# Altium project XTMCU02.PrjPcb
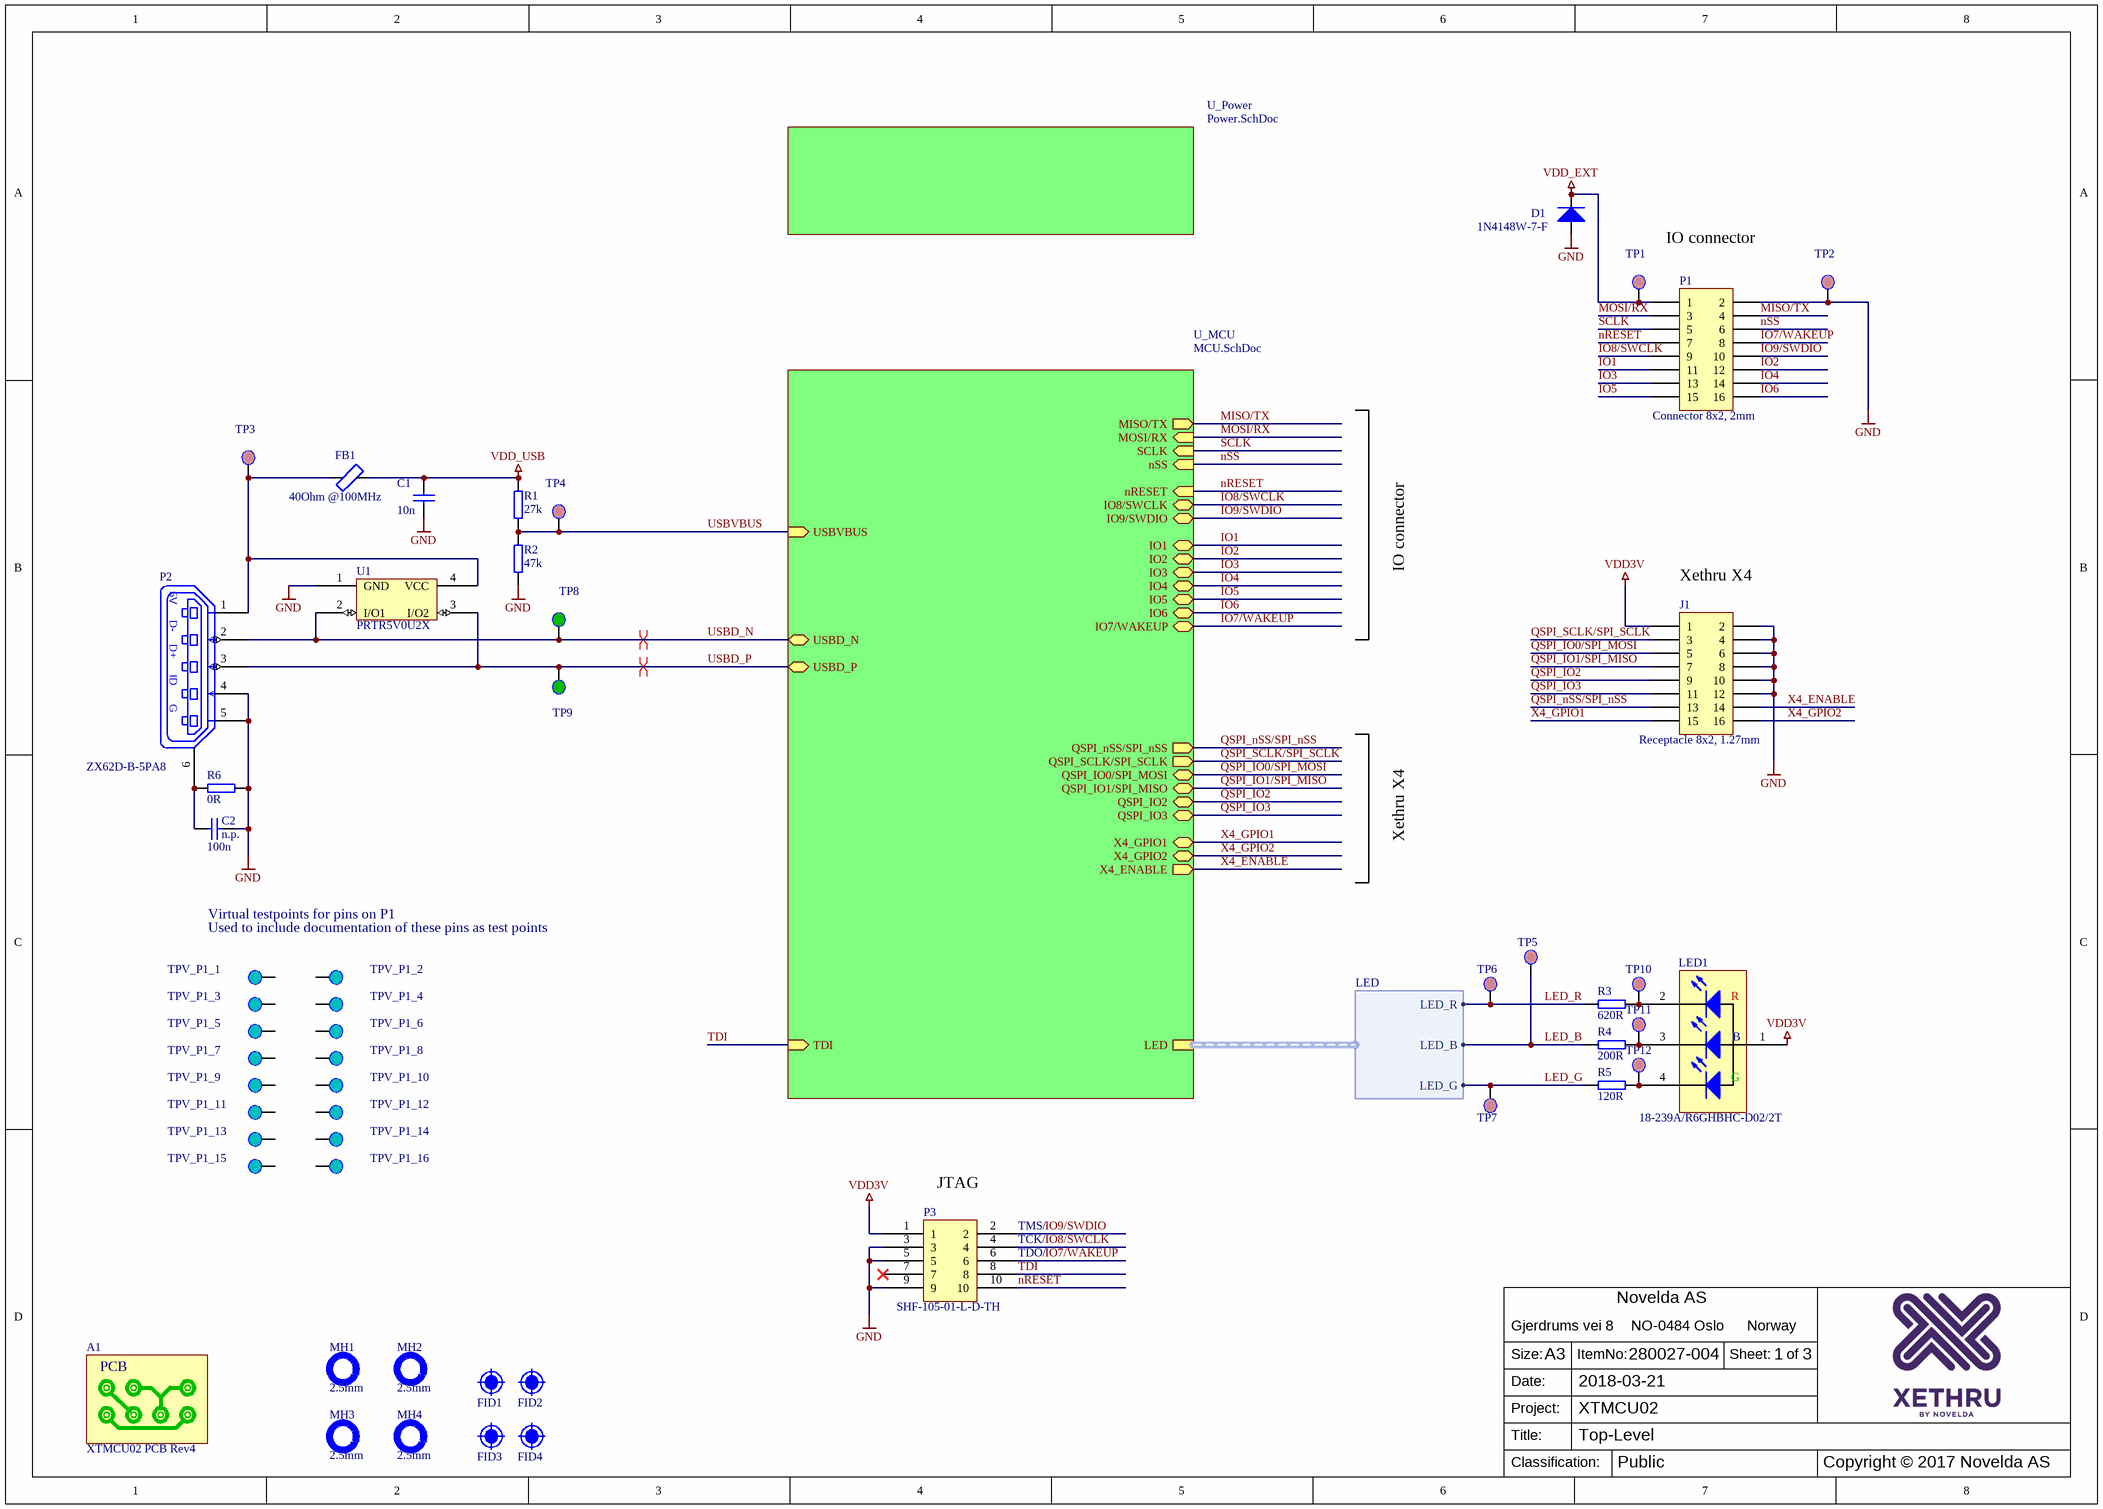
[diagram p0: Top-level.SchDoc]
PCBA_ProjectName: XTMCU02; PCBA_ItemNo: 280027-004; PCBA_Description: Cortex M7 based MCU card for use with X4 radar modules; PCBA_Date: 2018-03-21; PCBA_Classification: Public; PCB_ItemNo: 290052-004; PCB_Date: 2018-03-21; PCB_Classification: Public
3 sheets, 126 parts. Net scope: hierarchical (ports join the sheet entries above them; power ports are global).
Board file: XTMCU02.PcbDoc
Sheets:
  Top-level.SchDoc
    U_MCU = MCU.SchDoc
    U_Power = Power.SchDoc

## Sheet Top-level.SchDoc: Top-Level
size A3; CompanyName: Novelda AS; Organization: Novelda AS; Address1: Gjerdrums vei 8; Address2: NO-0484 Oslo; Address3: Norway; Revision: 1.A; SheetNumber: 1; SheetTotal: 3; Classification: Restricted; Size: A3; Project: X4M01; ProjectName: Prosject Name

### Parts
A1  XTMCU02 PCB Rev4  (mechanical)
C1  10n  [0402-CAPACITOR-NONPOL]
C2  100n  Notes: n.p.  [0603-CAPACITOR-NONPOL]
D1  1N4148W-7-F  [200048]
FB1  40Ohm @100MHz  [200017]
FID1  Fiducial  [ALTIUM-0005]  (value not drawn)  (no BOM)
FID2  Fiducial  [ALTIUM-0005]  (value not drawn)  (no BOM)
FID3  Fiducial  [ALTIUM-0005]  (value not drawn)  (no BOM)
FID4  Fiducial  [ALTIUM-0005]  (value not drawn)  (no BOM)
J1  Receptacle 8x2, 1.27mm  [200283]
LED1  18-239A/R6GHBHC-D02/2T  [200018]
MH1  2.5mm  [ALTIUM-0003]  (no BOM)
MH2  2.5mm  [ALTIUM-0003]  (no BOM)
MH3  2.5mm  [ALTIUM-0003]  (no BOM)
MH4  2.5mm  [ALTIUM-0003]  (no BOM)
P1  Connector 8x2, 2mm  [200019]
P2  ZX62D-B-5PA8  [200020]
P3  SHF-105-01-L-D-TH  [200073]
R1  27k  [0402-RESISTOR]
R2  47k  [0402-RESISTOR]
R3  620R  [0402-RESISTOR]
R4  200R  [0402-RESISTOR]
R5  120R  [0402-RESISTOR]
R6  0R  [0603-RESISTOR]
TP1  TP-MDA  [ALTIUM-0001]  (value not drawn)  (no BOM)
TP2  TP-MDA  [ALTIUM-0001]  (value not drawn)  (no BOM)
TP3  TP-MDA  [ALTIUM-0001]  (value not drawn)  (no BOM)
TP4  TP-MDA  [ALTIUM-0001]  (value not drawn)  (no BOM)
TP5  TP-MDA  [ALTIUM-0001]  (value not drawn)  (no BOM)
TP6  TP-MDA  [ALTIUM-0001]  (value not drawn)  (no BOM)
TP7  TP-MDA  [ALTIUM-0001]  (value not drawn)  (no BOM)
TP8  TP  [ALTIUM-0001]  (value not drawn)  (no BOM)
TP9  TP  [ALTIUM-0001]  (value not drawn)  (no BOM)
TP10  TP-MDA  [ALTIUM-0001]  (value not drawn)  (no BOM)
TP11  TP-MDA  [ALTIUM-0001]  (value not drawn)  (no BOM)
TP12  TP-MDA  [ALTIUM-0001]  (value not drawn)  (no BOM)
TPV_P1_1  TPV  (value not drawn)  (graphical)
TPV_P1_2  TPV  (value not drawn)  (graphical)
TPV_P1_3  TPV  (value not drawn)  (graphical)
TPV_P1_4  TPV  (value not drawn)  (graphical)
TPV_P1_5  TPV  (value not drawn)  (graphical)
TPV_P1_6  TPV  (value not drawn)  (graphical)
TPV_P1_7  TPV  (value not drawn)  (graphical)
TPV_P1_8  TPV  (value not drawn)  (graphical)
TPV_P1_9  TPV  (value not drawn)  (graphical)
TPV_P1_10  TPV  (value not drawn)  (graphical)
TPV_P1_11  TPV  (value not drawn)  (graphical)
TPV_P1_12  TPV  (value not drawn)  (graphical)
TPV_P1_13  TPV  (value not drawn)  (graphical)
TPV_P1_14  TPV  (value not drawn)  (graphical)
TPV_P1_15  TPV  (value not drawn)  (graphical)
TPV_P1_16  TPV  (value not drawn)  (graphical)
U1  PRTR5V0U2X  [200051]

### Sub-sheets
U_MCU = MCU.SchDoc: nRESET (in), IO7/WAKEUP (bidir), IO9/SWDIO (bidir), IO8/SWCLK (bidir), IO2 (bidir), IO1 (bidir), IO4 (bidir), IO3 (bidir), USBD_P (bidir), USBD_N (bidir), IO5 (bidir), IO6 (bidir), USBVBUS (in), MISO/TX (out), MOSI/RX (in), SCLK (in), nSS (in), LED (harness LED), QSPI_nSS/SPI_nSS (out), QSPI_IO1/SPI_MISO (bidir), QSPI_IO0/SPI_MOSI (bidir), QSPI_IO3 (bidir), QSPI_SCLK/SPI_SCLK (out), X4_GPIO2 (bidir), X4_GPIO1 (bidir), X4_ENABLE (out), QSPI_IO2 (bidir), TDI (in)
U_Power = Power.SchDoc: no entries

### Harnesses
LED: LED_R, LED_B, LED_G

### Nets
GND: C1.1 C2.2 D1.A J1.2 J1.4 J1.6 J1.8 J1.10 J1.12 P1.2 P2.4(ID) P2.5(G) P3.3 P3.5 P3.9 R2.1 R6.2 TP2.1 U1.1(GND)
VDD3V: J1.1 LED1.1(A) P3.1
VDD_EXT: D1.K P1.1 TP1.1
VDD_USB: C1.2 FB1.1 R1.1
IO1: P1.11 ; sheet U_MCU/IO1
IO2: P1.12 ; sheet U_MCU/IO2
IO3: P1.13 ; sheet U_MCU/IO3
IO4: P1.14 ; sheet U_MCU/IO4
IO5: P1.15 ; sheet U_MCU/IO5
IO6: P1.16 ; sheet U_MCU/IO6
IO7/WAKEUP: P1.8 P3.6 ; sheet U_MCU/IO7/WAKEUP
IO8/SWCLK: P1.9 P3.4 ; sheet U_MCU/IO8/SWCLK
IO9/SWDIO: P1.10 P3.2 ; sheet U_MCU/IO9/SWDIO
LED_B: R4.2 TP5.1 ; sheet U_MCU/LED.LED_B
LED_G: R5.2 TP7.1 ; sheet U_MCU/LED.LED_G
LED_R: R3.2 TP6.1 ; sheet U_MCU/LED.LED_R
MISO/TX: P1.4 ; sheet U_MCU/MISO/TX
MOSI/RX: P1.3 ; sheet U_MCU/MOSI/RX
nRESET: P1.7 P3.10 ; sheet U_MCU/nRESET
nSS: P1.6 ; sheet U_MCU/nSS
QSPI_IO0/SPI_MOSI: J1.5 ; sheet U_MCU/QSPI_IO0/SPI_MOSI
QSPI_IO1/SPI_MISO: J1.7 ; sheet U_MCU/QSPI_IO1/SPI_MISO
QSPI_IO2: J1.9 ; sheet U_MCU/QSPI_IO2
QSPI_IO3: J1.11 ; sheet U_MCU/QSPI_IO3
QSPI_nSS/SPI_nSS: J1.13 ; sheet U_MCU/QSPI_nSS/SPI_nSS
QSPI_SCLK/SPI_SCLK: J1.3 ; sheet U_MCU/QSPI_SCLK/SPI_SCLK
SCLK: P1.5 ; sheet U_MCU/SCLK
TDI: P3.8 ; sheet U_MCU/TDI
USBD_N: P2.2(D-) TP8.1 U1.2(I/O1) ; sheet U_MCU/USBD_N
USBD_P: P2.3(D+) TP9.1 U1.3(I/O2) ; sheet U_MCU/USBD_P
USBVBUS: R1.2 R2.2 TP4.1 ; sheet U_MCU/USBVBUS
X4_ENABLE: J1.14 ; sheet U_MCU/X4_ENABLE
X4_GPIO1: J1.15 ; sheet U_MCU/X4_GPIO1
X4_GPIO2: J1.16 ; sheet U_MCU/X4_GPIO2
NetC2_1: C2.1 P2.6(SH) R6.1
NetFB1_2: FB1.2 P2.1(5V) TP3.1 U1.4(VCC)
NetLED1_2: LED1.2(K_RED) R3.1 TP10.1
NetLED1_3: LED1.3(K_BLUE) R4.1 TP11.1
NetLED1_4: LED1.4(K_GREEN) R5.1 TP12.1

Not connected (* = marked no-connect by the designer): P3 7*; TPV_P1_1 1; TPV_P1_2 1; TPV_P1_3 1; TPV_P1_4 1; TPV_P1_5 1; TPV_P1_6 1; TPV_P1_7 1; TPV_P1_8 1; TPV_P1_9 1; TPV_P1_10 1; TPV_P1_11 1; TPV_P1_12 1; TPV_P1_13 1; TPV_P1_14 1; TPV_P1_15 1; TPV_P1_16 1

### Layout directives
differential pair: USBD_N, USBD_P

### Notes on the sheet
- IO connector
- (near J1) Xethru X4
- Xethru X4
- Virtual testpoints for pins on P1
- Used to include documentation of these pins as test points
- (near P3) JTAG
- (near P3) TMS/
- (near P3) TCK/
- (near P3) TDO/
- Size:
- Date:
- ItemNo:
- Sheet:
- of
- Title:
- Project:
- Classification:
- Copyright © 2017 Novelda AS
- (in symbol 200018) R; B; G

### Library data of the parts
A1 = 290052-004: Manufacturer: Novelda; Component Status: New; ItemNo: 290052-004; Value: XTMCU02 PCB Rev4; Component Category: PCB; MPN: 290052-004; ClassName: -; Notes: -
C1 = 200005: CAPACITOR, 10n, 0402, 20%, 25V, X7R; ItemNo: 200005; Component Status: Active; Value: 10n; Component Category: Capacitor; Manufacturer: --; Supplier: Farnell Norge; SupplierCatNo: 1758924
C2 = 200152: CAPACITOR, 100n, 0603, 10%, 16V, X7R; ItemNo: 200152; Component Status: New; Value: 100n; Component Category: Capacitor; Manufacturer: --; Supplier: Farnell Norge; SupplierCatNo: 1759016; ClassName: -
D1 = 200164: DIODE, 1N4148W-7-F, SWITCH, 300MA, 100V, SOD123; ItemNo: 200164; Component Status: New; Value: 1N4148W-7-F; Component Category: Diode; Manufacturer: --; ClassName: -; Notes: -; Supplier: Digi-Key; SupplierCatNo: 1N4148W-FDICT-ND
FB1 = 200017: FERRITE 1.5A 40 OHM 0805 SMD; Manufacturer: Laird-Signal Integrity Product; MPN: MI0805K400R-10; Component Status: Active; Component Category: Inductor; ItemNo: 200017; Value: 40Ohm @100MHz; Supplier: Digi-Key; SupplierCatNo: 240-2389-1-ND
FID1-FID4 = ALTIUM-0005: Fiduial 1.1mm; Component Status: Active; Component Category: Misc; ItemNo: ALTIUM-0005; Value: Fiducial; ClassName: Fiducial
J1 = 200283: CONNECTOR, RECEPTACLE, 1.27MM, THT, 8WAY, 2ROW; Manufacturer: Harwin; MPN: M50-3000845; Component Status: New; ItemNo: 200283; Value: Receptacle 8x2, 1.27mm; Component Category: Connector; ClassName: -; Notes: -; Supplier: Digi-Key; SupplierCatNo: 952-1367-5-ND
LED1 = 200018: LED RGB, 0404, Everlight 18-239A/R6GHBHC-D02/2T; Int_Manufacturer: Lumex; Component Status: New; ItemNo: 200018; Value: 18-239A/R6GHBHC-D02/2T; Component Category: LED; Manufacturer: Everlight; MPN: 18-239A/R6GHBHC-D02/2T; Supplier: Digi-Key; SupplierCatNo: 67-2125-1-ND
MH1-MH4 = ALTIUM-0003: MOUNTING-HOLE-2.5mm, WITHOUT NET; Component Status: Active; Component Category: Misc; ItemNo: ALTIUM-0003; Value: 2.5mm
P1 = 200019: BOARD-BOARD CONNECTOR HEADER, 8WAY, 2ROW, 2MM PITCH; Manufacturer: PINREX; MPN: 220-92-08GB22; Component Status: Active; ItemNo: 200019; Value: Connector 8x2, 2mm; Component Category: Connector; Supplier: Farnell Norge; SupplierCatNo: 1668543
P2 = 200020: CONNECTOR, MICRO USB, RECEPTACLE, 5WAY; Manufacturer: Hirose; Component Status: Active; ItemNo: 200020; Value: ZX62D-B-5PA8; Component Category: Connector; MPN: ZX62D-B-5PA8; Supplier: Farnell Norge; SupplierCatNo: 2300438
P3 = 200073: CONNECTOR, 1.27MM, THRU HOLE, 2X5WAY; Manufacturer: Samtec; Component Status: Active; ItemNo: 200073; Value: SHF-105-01-L-D-TH; Component Category: Connector; MPN: SHF-105-01-L-D-TH; ClassName: -; Notes: -; Supplier: Farnell Norge; SupplierCatNo: 2308450
R1 = 200062: RESISTOR, 27k, 0402, 1%, 63mW; ItemNo: 200062; Component Status: Active; Value: 27k; Component Category: Resistor; Manufacturer: --; Supplier: Farnell Norge; SupplierCatNo: 2331498
R2 = 200063: RESISTOR, 47k, 0402, 1%, 63mW; ItemNo: 200063; Component Status: Active; Value: 47k; Component Category: Resistor; Manufacturer: --; Supplier: Farnell Norge; SupplierCatNo: 1469719
R3 = 200032: RESISTOR, 620R, 0402, 1%, 63mW; ItemNo: 200032; Component Status: Active; Value: 620R; Component Category: Resistor; Manufacturer: --; Supplier: Farnell Norge; SupplierCatNo: 2331552
R4 = 200031: RESISTOR, 200R, 0402, 1%, 63mW; ItemNo: 200031; Component Status: Active; Value: 200R; Component Category: Resistor; Manufacturer: --; Supplier: Farnell Norge; SupplierCatNo: 2331484
R5 = 200030: RESISTOR, 120R, 0402, 1%, 63mW; ItemNo: 200030; Component Status: Active; Value: 120R; Component Category: Resistor; Manufacturer: --; Supplier: Farnell Norge; SupplierCatNo: 2331452
R6 = 200305: RESISTOR, 0R, 0603, 1%, 100mW; ItemNo: 200305; Component Status: New; Value: 0R; Component Category: Resistor; Manufacturer: --; Supplier: Farnell Norge; SupplierCatNo: 2309111; ClassName: -; Notes: -
TP1 TP2 TP4-TP7 TP10-TP12 = ALTIUM-0023: TESTPOINT FOR MDA-TEST, 1mm ROUND, SMD; Component Status: Active; Component Category: Misc; TP_Type: MDA; ItemNo: ALTIUM-0023; Value: TP-MDA; ClassName: MDA-Testpoint
TP3 = ALTIUM-0023: TESTPOINT FOR MDA-TEST, 1mm ROUND, SMD; Component Status: Active; Component Category: Misc; TP_Type: Testjig,MDA; TP_LegalValueRange: 4.5V - 5.5V; TP_Notes: USB supply voltage; ItemNo: ALTIUM-0023; Value: TP-MDA; ClassName: MDA-Testpoint
TP8 = ALTIUM-0001: TESTPOINT, 1mm ROUND, SMD; Component Status: Active; Component Category: Misc; TP_Type: Testjig; TP_Notes: USB Data-; ItemNo: ALTIUM-0001; Value: TP; ClassName: Testpoint
TP9 = ALTIUM-0001: TESTPOINT, 1mm ROUND, SMD; Component Status: Active; Component Category: Misc; TP_Type: Testjig; TP_Notes: USB Data+; ItemNo: ALTIUM-0001; Value: TP; ClassName: Testpoint
TPV_P1_1 = ALTIUM-0007: TESTPOINT, Virtual, Only on schematic, Used when actual testpoint is other component pins.; Component Status: Active; Component Category: Misc; TP_Type: Testjig; TP_LegalValueRange: 4.5V - 5.5V; TP_Notes: External voltage input; ItemNo: ALTIUM-0007; Value: TPV; ClassName: Testpoint
TPV_P1_2 = ALTIUM-0007: TESTPOINT, Virtual, Only on schematic, Used when actual testpoint is other component pins.; Component Status: Active; Component Category: Misc; TP_Type: Testjig; TP_LegalValueRange: 0V; TP_Notes: GND; ItemNo: ALTIUM-0007; Value: TPV; ClassName: Testpoint
TPV_P1_3 = ALTIUM-0007: TESTPOINT, Virtual, Only on schematic, Used when actual testpoint is other component pins.; Component Status: Active; Component Category: Misc; TP_Type: Testjig; TP_Notes: SPI MOSI/UART RX; ItemNo: ALTIUM-0007; Value: TPV; ClassName: Testpoint
TPV_P1_4 = ALTIUM-0007: TESTPOINT, Virtual, Only on schematic, Used when actual testpoint is other component pins.; Component Status: Active; Component Category: Misc; TP_Type: Testjig; TP_Notes: SPI MISO/UART TX; ItemNo: ALTIUM-0007; Value: TPV; ClassName: Testpoint
TPV_P1_5 = ALTIUM-0007: TESTPOINT, Virtual, Only on schematic, Used when actual testpoint is other component pins.; Component Status: Active; Component Category: Misc; TP_Type: Testjig; TP_Notes: SPI SCLK; ItemNo: ALTIUM-0007; Value: TPV; ClassName: Testpoint
TPV_P1_6 = ALTIUM-0007: TESTPOINT, Virtual, Only on schematic, Used when actual testpoint is other component pins.; Component Status: Active; Component Category: Misc; Notes: Active Low; TP_Type: Testjig; TP_Notes: SPI NSS; ItemNo: ALTIUM-0007; Value: TPV; ClassName: Testpoint
TPV_P1_7 = ALTIUM-0007: TESTPOINT, Virtual, Only on schematic, Used when actual testpoint is other component pins.; Component Status: Active; Component Category: Misc; Notes: Use for programming; TP_Type: Testjig; TP_Notes: MCU nRESET; ItemNo: ALTIUM-0007; Value: TPV; ClassName: Testpoint
TPV_P1_8 = ALTIUM-0007: TESTPOINT, Virtual, Only on schematic, Used when actual testpoint is other component pins.; Component Status: Active; Component Category: Misc; TP_Type: Testjig; TP_Notes: IO7/WAKEUP; ItemNo: ALTIUM-0007; Value: TPV; ClassName: Testpoint
TPV_P1_9 = ALTIUM-0007: TESTPOINT, Virtual, Only on schematic, Used when actual testpoint is other component pins.; Component Status: Active; Component Category: Misc; TP_Type: Testjig; TP_Notes: IO8/SWCLK; ItemNo: ALTIUM-0007; Value: TPV; ClassName: Testpoint
TPV_P1_10 = ALTIUM-0007: TESTPOINT, Virtual, Only on schematic, Used when actual testpoint is other component pins.; Component Status: Active; Component Category: Misc; TP_Type: Testjig; TP_Notes: IO9/SWDIO; ItemNo: ALTIUM-0007; Value: TPV; ClassName: Testpoint
TPV_P1_11 = ALTIUM-0007: TESTPOINT, Virtual, Only on schematic, Used when actual testpoint is other component pins.; Component Status: Active; Component Category: Misc; TP_Type: Testjig; TP_Notes: IO1; ItemNo: ALTIUM-0007; Value: TPV; ClassName: Testpoint
TPV_P1_12 = ALTIUM-0007: TESTPOINT, Virtual, Only on schematic, Used when actual testpoint is other component pins.; Component Status: Active; Component Category: Misc; TP_Type: Testjig; TP_Notes: IO2; ItemNo: ALTIUM-0007; Value: TPV; ClassName: Testpoint
TPV_P1_13 = ALTIUM-0007: TESTPOINT, Virtual, Only on schematic, Used when actual testpoint is other component pins.; Component Status: Active; Component Category: Misc; TP_Type: Testjig; TP_Notes: IO3; ItemNo: ALTIUM-0007; Value: TPV; ClassName: Testpoint
TPV_P1_14 = ALTIUM-0007: TESTPOINT, Virtual, Only on schematic, Used when actual testpoint is other component pins.; Component Status: Active; Component Category: Misc; TP_Type: Testjig; TP_Notes: IO4; ItemNo: ALTIUM-0007; Value: TPV; ClassName: Testpoint
TPV_P1_15 = ALTIUM-0007: TESTPOINT, Virtual, Only on schematic, Used when actual testpoint is other component pins.; Component Status: Active; Component Category: Misc; TP_Type: Testjig; TP_Notes: IO5; ItemNo: ALTIUM-0007; Value: TPV; ClassName: Testpoint
TPV_P1_16 = ALTIUM-0007: TESTPOINT, Virtual, Only on schematic, Used when actual testpoint is other component pins.; Component Status: Active; Component Category: Misc; TP_Type: Testjig; TP_Notes: IO6; ItemNo: ALTIUM-0007; Value: TPV; ClassName: Testpoint
U1 = 200051: DIODE PROTECTION, TVS, DUAL; Manufacturer: NXP; Component Status: Active; ItemNo: 200051; Value: PRTR5V0U2X; Component Category: Diode; MPN: PRTR5V0U2X; Supplier: Farnell Norge; SupplierCatNo: 2371119

## Sheet MCU.SchDoc: MCU
size A3; CompanyName: Novelda AS; Organization: Novelda AS; Address1: Gjerdrums vei 8; Address2: NO-0484 Oslo; Address3: Norway; Revision: 1.A; SheetNumber: 3; SheetTotal: 3; Classification: Restricted; Size: A3; Project: X4M01; ProjectName: Prosject Name
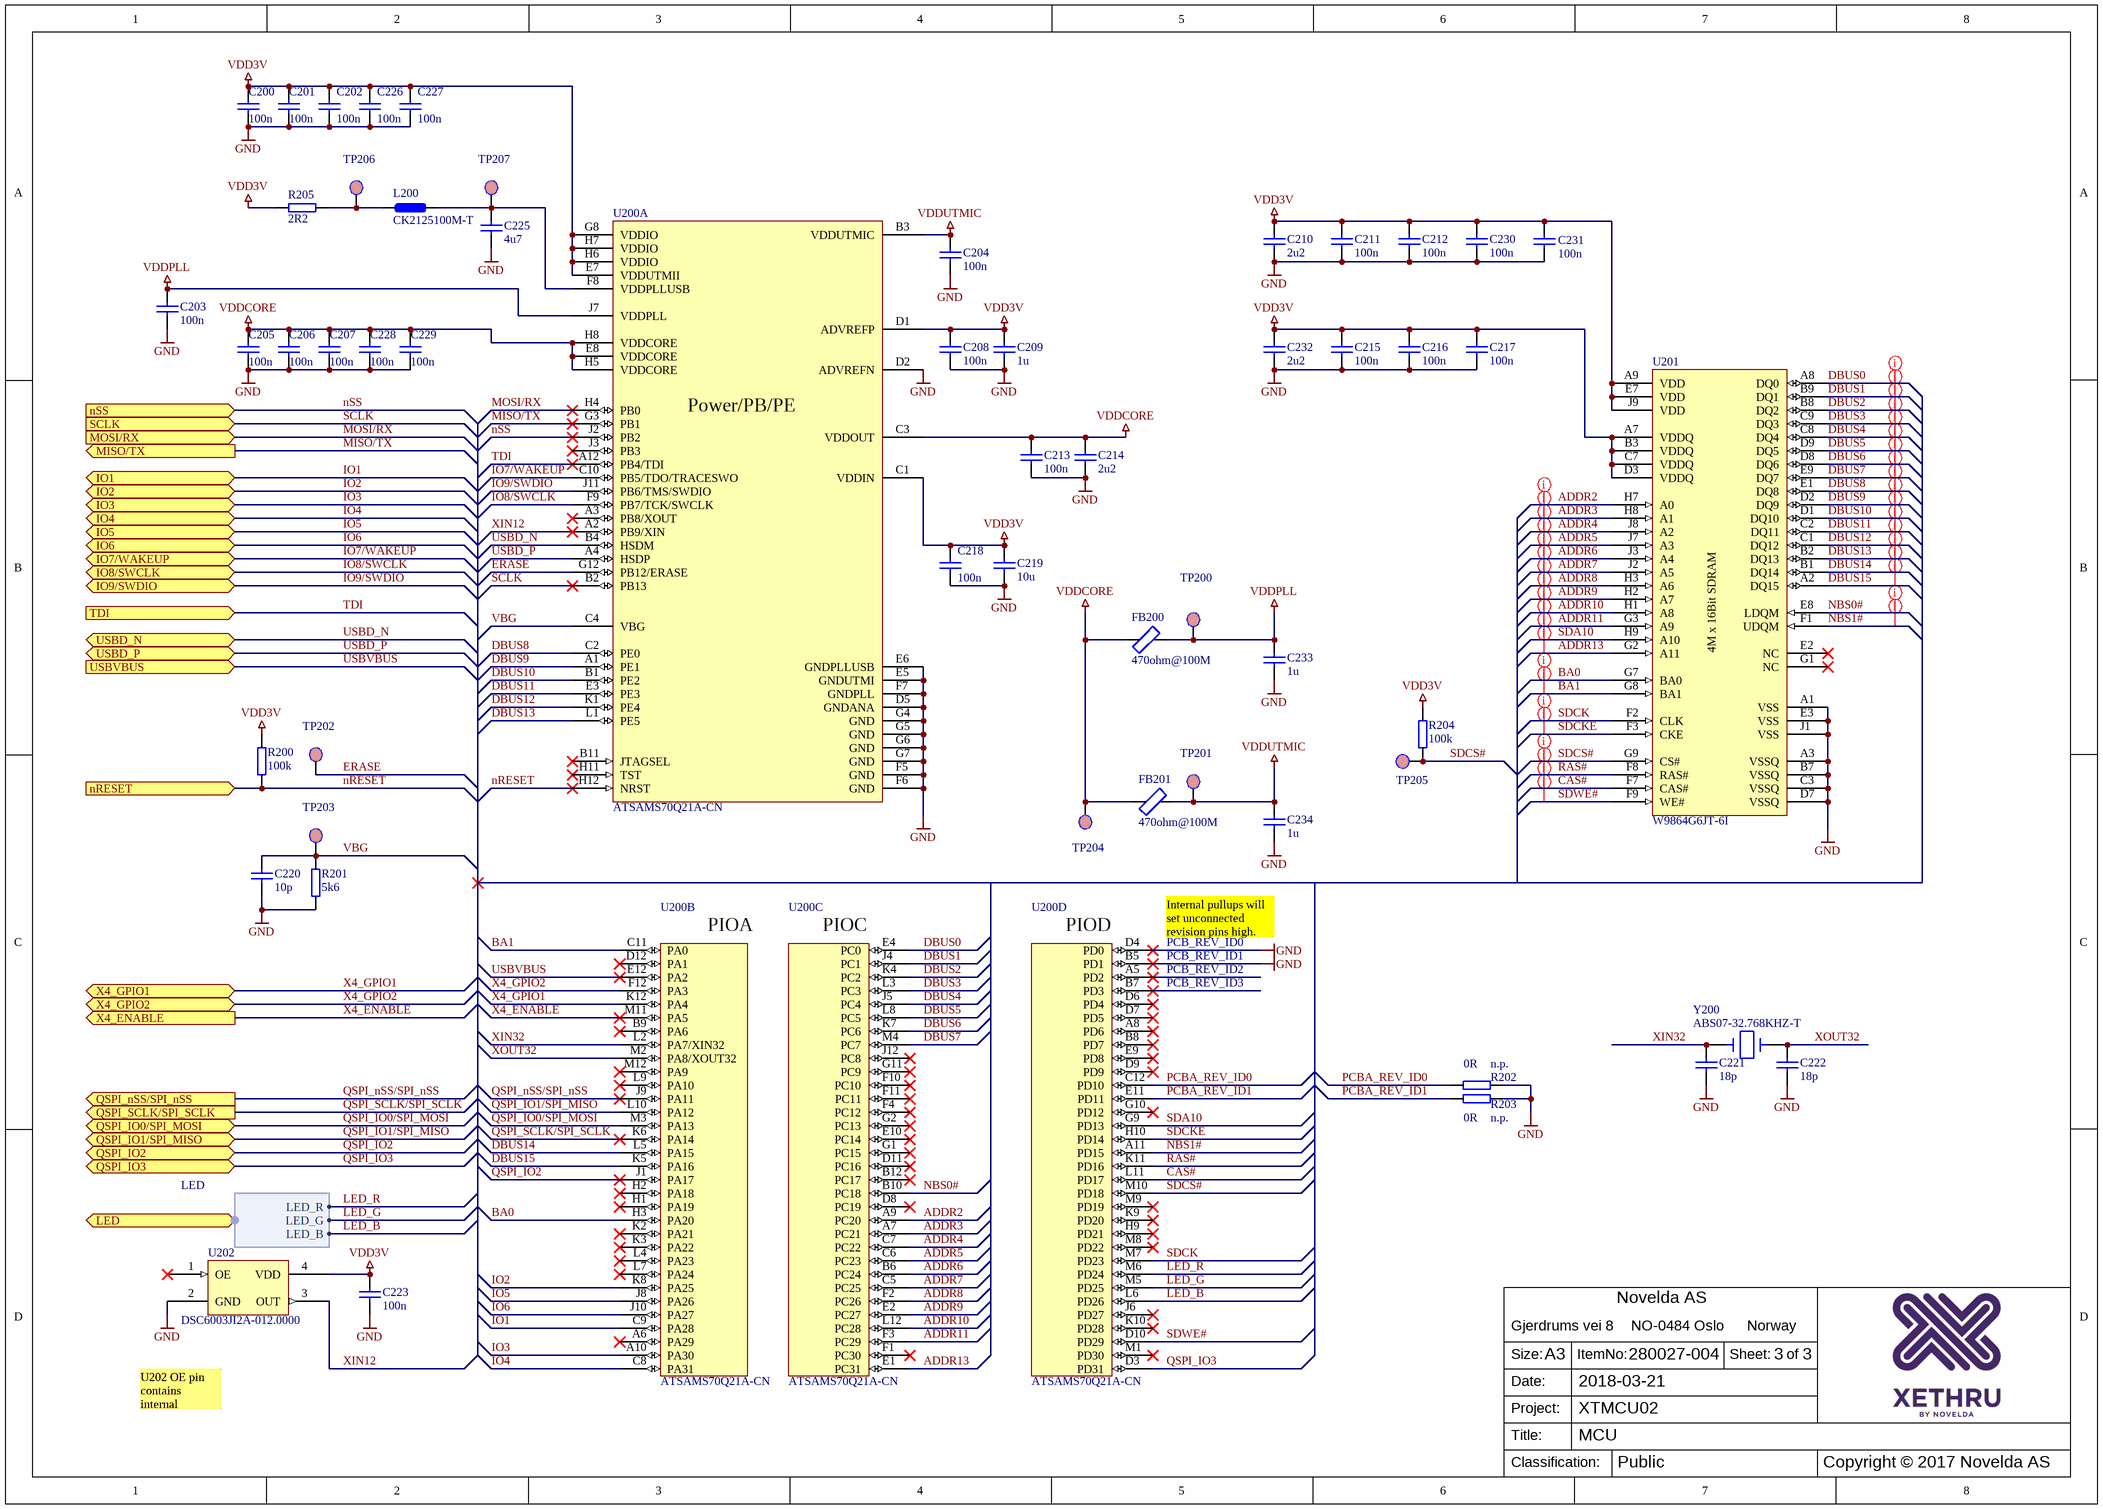
[diagram p1: MCU.SchDoc]

### Parts
C200  100n  [0402-CAPACITOR-NONPOL]
C201  100n  [0402-CAPACITOR-NONPOL]
C202  100n  [0402-CAPACITOR-NONPOL]
C203  100n  [0402-CAPACITOR-NONPOL]
C204  100n  [0402-CAPACITOR-NONPOL]
C205  100n  [0402-CAPACITOR-NONPOL]
C206  100n  [0402-CAPACITOR-NONPOL]
C207  100n  [0402-CAPACITOR-NONPOL]
C208  100n  [0402-CAPACITOR-NONPOL]
C209  1u  [0402-CAPACITOR-NONPOL]
C210  2u2  [0402-CAPACITOR-NONPOL]
C211  100n  [0402-CAPACITOR-NONPOL]
C212  100n  [0402-CAPACITOR-NONPOL]
C213  100n  [0402-CAPACITOR-NONPOL]
C214  2u2  [0402-CAPACITOR-NONPOL]
C215  100n  [0402-CAPACITOR-NONPOL]
C216  100n  [0402-CAPACITOR-NONPOL]
C217  100n  [0402-CAPACITOR-NONPOL]
C218  100n  [0402-CAPACITOR-NONPOL]
C219  10u  [0603-CAPACITOR-NONPOL]
C220  10p  [0402-CAPACITOR-NONPOL]
C221  18p  [0402-CAPACITOR-NONPOL]
C222  18p  [0402-CAPACITOR-NONPOL]
C223  100n  [0402-CAPACITOR-NONPOL]
C225  4u7  [0603-CAPACITOR-NONPOL]
C226  100n  [0402-CAPACITOR-NONPOL]
C227  100n  [0402-CAPACITOR-NONPOL]
C228  100n  [0402-CAPACITOR-NONPOL]
C229  100n  [0402-CAPACITOR-NONPOL]
C230  100n  [0402-CAPACITOR-NONPOL]
C231  100n  [0402-CAPACITOR-NONPOL]
C232  2u2  [0402-CAPACITOR-NONPOL]
C233  1u  [0402-CAPACITOR-NONPOL]
C234  1u  [0402-CAPACITOR-NONPOL]
FB200  470ohm@100M  [200047]
FB201  470ohm@100M  [200047]
L200  CK2125100M-T  [200364]
R200  100k  [0402-RESISTOR]
R201  5k6  [0402-RESISTOR]
R202  0R  Notes: n.p.  [0402-RESISTOR]
R203  0R  Notes: n.p.  [0402-RESISTOR]
R204  100k  [0402-RESISTOR]
R205  2R2  [0402-RESISTOR]
TP200  TP-MDA  [ALTIUM-0001]  (value not drawn)  (no BOM)
TP201  TP-MDA  [ALTIUM-0001]  (value not drawn)  (no BOM)
TP202  TP-MDA  [ALTIUM-0001]  (value not drawn)  (no BOM)
TP203  TP-MDA  [ALTIUM-0001]  (value not drawn)  (no BOM)
TP204  TP-MDA  [ALTIUM-0001]  (value not drawn)  (no BOM)
TP205  TP-MDA  [ALTIUM-0001]  (value not drawn)  (no BOM)
TP206  TP-MDA  [ALTIUM-0001]  (value not drawn)  (no BOM)
TP207  TP-MDA  [ALTIUM-0001]  (value not drawn)  (no BOM)
U200  ATSAMS70Q21A-CN  [200353]  (parts A,B,C,D of 4)
U201  W9864G6JT-6I  [200282]
U202  DSC6003JI2A-012.0000  [200365]
Y200  ABS07-32.768KHZ-T  [200042]

### Ports
IO1 (bidir), IO2 (bidir), IO3 (bidir), IO4 (bidir), IO5 (bidir), IO6 (bidir), IO7/WAKEUP (bidir), IO8/SWCLK (bidir), IO9/SWDIO (bidir), LED (harness LED), MISO/TX (out), MOSI/RX (in), nRESET (in), nSS (in), QSPI_IO0/SPI_MOSI (bidir), QSPI_IO1/SPI_MISO (bidir), QSPI_IO2 (bidir), QSPI_IO3 (bidir), QSPI_nSS/SPI_nSS (out), QSPI_SCLK/SPI_SCLK (out), SCLK (in), TDI (in), USBD_N (bidir), USBD_P (bidir), USBVBUS (in), X4_ENABLE (out), X4_GPIO1 (bidir), X4_GPIO2 (bidir)

### Harnesses
LED: LED_R, LED_B, LED_G

### Nets
GND: C200.2 C201.1 C202.1 C203.1 C204.1 C205.2 C206.1 C207.1 C208.1 C209.1 C210.2 C211.1 C212.1 C213.1 C214.2 C215.1 C216.1 C217.1 C218.1 C219.1 C220.2 C221.1 C222.1 C223.2 C225.1 C226.1 C227.1 C228.1 C229.1 C230.1 C231.1 C232.2 C233.1 C234.1 R201.1 R202.2 R203.2 U200.B5(PD1) U200.D2(ADVREFN) U200.D4(PD0) U200.D5(GNDANA) U200.E5(GNDUTMI) U200.E6(GNDPLLUSB) U200.F5(GND) U200.F6(GND) U200.F7(GNDPLL) U200.G4(GND) U200.G5(GND) U200.G6(GND) U200.G7(GND) U201.A1(VSS) U201.A3(VSSQ) U201.B7(VSSQ) U201.C3(VSSQ) U201.D7(VSSQ) U201.E3(VSS) U201.J1(VSS) U202.2(GND)
VDD3V: C200.1 C201.2 C202.2 C208.2 C209.2 C210.1 C211.2 C212.2 C215.2 C216.2 C217.2 C218.2 C219.2 C223.1 C226.2 C227.2 C230.2 C231.2 C232.1 R200.2 R204.2 R205.1 U200.C1(VDDIN) U200.D1(ADVREFP) U200.E7(VDDUTMII) U200.G8(VDDIO) U200.H6(VDDIO) U200.H7(VDDIO) U201.A7(VDDQ) U201.A9(VDD) U201.B3(VDDQ) U201.C7(VDDQ) U201.D3(VDDQ) U201.E7(VDD) U201.J9(VDD) U202.4(VDD)
VDDCORE: C205.1 C206.2 C207.2 C213.2 C214.1 C228.2 C229.2 FB200.1 FB201.1 TP204.1 U200.C3(VDDOUT) U200.E8(VDDCORE) U200.H5(VDDCORE) U200.H8(VDDCORE)
VDDPLL: C203.2 C233.2 FB200.2 TP200.1 U200.J7(VDDPLL)
VDDUTMIC: C204.2 C234.2 FB201.2 TP201.1 U200.B3(VDDUTMIC)
ADDR2: U200.A9(PC20) U201.H7(A0)
ADDR3: U200.A7(PC21) U201.H8(A1)
ADDR4: U200.C7(PC22) U201.J8(A2)
ADDR5: U200.C6(PC23) U201.J7(A3)
ADDR6: U200.B6(PC24) U201.J3(A4)
ADDR7: U200.C5(PC25) U201.J2(A5)
ADDR8: U200.F2(PC26) U201.H3(A6)
ADDR9: U200.E2(PC27) U201.H2(A7)
ADDR10: U200.L12(PC28) U201.H1(A8)
ADDR11: U200.F3(PC29) U201.G3(A9)
ADDR13: U200.E1(PC31) U201.G2(A11)
BA0: U200.H3(PA20) U201.G7(BA0)
BA1: U200.C11(PA0) U201.G8(BA1)
CAS#: U200.L11(PD17) U201.F7(CAS#)
DBUS0: U200.E4(PC0) U201.A8(DQ0)
DBUS1: U200.J4(PC1) U201.B9(DQ1)
DBUS2: U200.K4(PC2) U201.B8(DQ2)
DBUS3: U200.L3(PC3) U201.C9(DQ3)
DBUS4: U200.J5(PC4) U201.C8(DQ4)
DBUS5: U200.L8(PC5) U201.D9(DQ5)
DBUS6: U200.K7(PC6) U201.D8(DQ6)
DBUS7: U200.M4(PC7) U201.E9(DQ7)
DBUS8: U200.C2(PE0) U201.E1(DQ8)
DBUS9: U200.A1(PE1) U201.D2(DQ9)
DBUS10: U200.B1(PE2) U201.D1(DQ10)
DBUS11: U200.E3(PE3) U201.C2(DQ11)
DBUS12: U200.K1(PE4) U201.C1(DQ12)
DBUS13: U200.L1(PE5) U201.B2(DQ13)
DBUS14: U200.L5(PA15) U201.B1(DQ14)
DBUS15: U200.K5(PA16) U201.A2(DQ15)
ERASE: TP202.1 U200.G12(PB12/ERASE)
IO1: U200.C9(PA28) ; port IO1
IO2: U200.K8(PA25) ; port IO2
IO3: U200.A10(PA30) ; port IO3
IO4: U200.C8(PA31) ; port IO4
IO5: U200.J8(PA26) ; port IO5
IO6: U200.J10(PA27) ; port IO6
IO7/WAKEUP: U200.C10(PB5/TDO/TRACESWO) ; port IO7/WAKEUP
IO8/SWCLK: U200.F9(PB7/TCK/SWCLK) ; port IO8/SWCLK
IO9/SWDIO: U200.J11(PB6/TMS/SWDIO) ; port IO9/SWDIO
LED_B: U200.L6(PD26) ; port LED.LED_B
LED_G: U200.M5(PD25) ; port LED.LED_G
LED_R: U200.M6(PD24) ; port LED.LED_R
MISO/TX: U200.G3(PB1) ; port MISO/TX
MOSI/RX: U200.H4(PB0) ; port MOSI/RX
NBS0#: U200.B10(PC18) U201.E8(LDQM)
NBS1#: U200.A11(PD15) U201.F1(UDQM)
nRESET: R200.1 U200.H12(NRST) ; port nRESET
nSS: U200.J2(PB2) ; port nSS
PCBA_REV_ID0: R202.1 U200.C12(PD10)
PCBA_REV_ID1: R203.1 U200.E11(PD11)
QSPI_IO0/SPI_MOSI: U200.M3(PA13) ; port QSPI_IO0/SPI_MOSI
QSPI_IO1/SPI_MISO: U200.L10(PA12) ; port QSPI_IO1/SPI_MISO
QSPI_IO2: U200.J1(PA17) ; port QSPI_IO2
QSPI_IO3: U200.D3(PD31) ; port QSPI_IO3
QSPI_nSS/SPI_nSS: U200.J9(PA11) ; port QSPI_nSS/SPI_nSS
QSPI_SCLK/SPI_SCLK: U200.K6(PA14) ; port QSPI_SCLK/SPI_SCLK
RAS#: U200.K11(PD16) U201.F8(RAS#)
SCLK: U200.B2(PB13) ; port SCLK
SDA10: U200.G9(PD13) U201.H9(A10)
SDCK: U200.M7(PD23) U201.F2(CLK)
SDCKE: U200.H10(PD14) U201.F3(CKE)
SDCS#: R204.1 TP205.1 U200.M10(PD18) U201.G9(CS#)
SDWE#: U200.D10(PD29) U201.F9(WE#)
TDI: U200.A12(PB4/TDI) ; port TDI
USBD_N: U200.B4(HSDM) ; port USBD_N
USBD_P: U200.A4(HSDP) ; port USBD_P
USBVBUS: U200.E12(PA2) ; port USBVBUS
VBG: C220.1 R201.2 TP203.1 U200.C4(VBG)
X4_ENABLE: U200.M11(PA5) ; port X4_ENABLE
X4_GPIO1: U200.K12(PA4) ; port X4_GPIO1
X4_GPIO2: U200.F12(PA3) ; port X4_GPIO2
XIN12: U200.A2(PB9/XIN) U202.3(OUT)
XIN32: C221.2 U200.L2(PA7/XIN32) Y200.1
XOUT32: C222.2 U200.M2(PA8/XOUT32) Y200.2
NetC225_2: C225.2 L200.2 TP207.1 U200.F8(VDDPLLUSB)
NetL200_1: L200.1 R205.2 TP206.1

Not connected (* = marked no-connect by the designer): U200 A3(PB8/XOUT)* A5(PD2)* A6(PA29)* A8(PD6)* B7(PD3)* B8(PD7)* B9(PA6)* B11(JTAGSEL)* B12(PC17)* D6(PD4)* D7(PD5)* D8(PC19)* D9(PD9)* D11(PC16)* D12(PA1)* E9(PD8)* E10(PC14)* F1(PC30)* F4(PC12)* F10(PC10)* F11(PC11)* G1(PC15)* G2(PC13)* G10(PD12)* G11(PC9)* H1(PA19)* H2(PA18)* H9(PD21)* H11(TST)* J3(PB3)* J6(PD27)* J12(PC8)* K2(PA21)* K3(PA22)* K9(PD20)* K10(PD28)* L4(PA23)* L7(PA24)* L9(PA10)* M1(PD30)* M8(PD22)* M9(PD19)* M12(PA9)*; U201 E2(NC)* G1(NC)*; U202 1(OE)*

### Layout directives
net class ADDRESS_BUS: ADDR2, ADDR3, ADDR4, ADDR5, ADDR6, ADDR7, ADDR8, ADDR9, ADDR10, ADDR11, ADDR13, BA0, BA1, CAS#, NBS0#, NBS1#, RAS#, SDA10, SDCK, SDCKE, SDCS#, SDWE#
net class DATA_BUS: DBUS0, DBUS1, DBUS2, DBUS3, DBUS4, DBUS5, DBUS6, DBUS7, DBUS8, DBUS9, DBUS10, DBUS11, DBUS12, DBUS13, DBUS14, DBUS15

### Notes on the sheet
- PCB_REV_ID0
- PCB_REV_ID1
- PCB_REV_ID2
- PCB_REV_ID3
- Internal pullups will set unconnected revision pins high.
- U202 OE pin
  contains internal
  pull-up
- Size:
- Date:
- ItemNo:
- Sheet:
- of
- Title:
- Project:
- Classification:
- Copyright © 2017 Novelda AS
- (in symbol 200282) 4M x 16Bit SDRAM
- (in symbol 200353, part A) Power/PB/PE
- (in symbol 200353, part B) PIOA
- (in symbol 200353, part C) PIOC
- (in symbol 200353, part D) PIOD

### Library data of the parts
C200-C208 C211-C213 C215-C218 C223 C226-C231 = 200010: CAPACITOR, 100n, 0402, 10%, 10V, X5R; ItemNo: 200010; Component Status: Active; Value: 100n; Component Category: Capacitor; Manufacturer: --; Supplier: Farnell Norge; SupplierCatNo: 1759380
C209 C233 C234 = 200001: CAPACITOR, 1u, 0402, 10%, 10V, X5R; ItemNo: 200001; Component Status: Active; Value: 1u; Component Category: Capacitor; Manufacturer: --; Supplier: Farnell Norge; SupplierCatNo: 1759381
C210 C214 C232 = 200000: CAPACITOR, 2u2, 0402, 20%, 6V3, X5R; ItemNo: 200000; Component Status: Active; Value: 2u2; Component Category: Capacitor; Manufacturer: --; Supplier: Farnell Norge; SupplierCatNo: 2362091
C219 = 200011: CAPACITOR, 10u, 0603, 20%, 6V3, X5R; ItemNo: 200011; Component Status: Active; Value: 10u; Component Category: Capacitor; Manufacturer: --; Supplier: Farnell Norge; SupplierCatNo: 2611921
C220 = 200008: CAPACITOR, 10p, 0402, 5%, 50V, NP0; ItemNo: 200008; Component Status: Active; Value: 10p; Component Category: Capacitor; Manufacturer: --; Supplier: Farnell Norge; SupplierCatNo: 2320761
C221 C222 = 200012: CAPACITOR, 18p, 0402, 5%, 50V, NP0; ItemNo: 200012; Component Status: Active; Value: 18p; Component Category: Capacitor; Manufacturer: --; Supplier: Farnell Norge; SupplierCatNo: 1758947
C225 = 200128: CAPACITOR, 4u7, 0603, 10%, 10V, X5R; ItemNo: 200128; Component Status: Active; Value: 4u7; Component Category: Capacitor; Manufacturer: --; Supplier: Farnell Norge; SupplierCatNo: 2320818; ClassName: -; Notes: -
FB200 FB201 = 200047: FERRITE BEAD, 470ohm@100MHz, 1A; Manufacturer: Murata; MPN: BLM18PG471SN1D; Component Status: New; Component Category: Inductor; ItemNo: 200047; Value: 470ohm@100M; Supplier: Digi-Key; SupplierCatNo: 490-5223-1-ND
L200 = 200364: INDUCTOR, 10u, 0805, 20%, 60mA, 650mOhm; Manufacturer: TAIYO YUDEN; Component Status: New; ItemNo: 200364; Value: CK2125100M-T; Component Category: Inductor; MPN: CK2125100M-T; Supplier: Farnell Norge; SupplierCatNo: 2112892; ClassName: -; Notes: -
R200 R204 = 200027: RESISTOR, 100k, 0402, 1%, 63mW; ItemNo: 200027; Component Status: Active; Value: 100k; Component Category: Resistor; Manufacturer: --; Supplier: Farnell Norge; SupplierCatNo: 9239472
R201 = 200064: RESISTOR, 5k6, 0402, 1%, 63mW; ItemNo: 200064; Component Status: Active; Value: 5k6; Component Category: Resistor; Manufacturer: --; Supplier: Farnell Norge; SupplierCatNo: 2331549
R202 R203 = 200021: RESISTOR, 0R, 0402, 5%, 63mW; ItemNo: 200021; Component Status: Active; Value: 0R; Component Category: Resistor; Manufacturer: --; Supplier: Farnell Norge; SupplierCatNo: 1469661
R205 = 200024: RESISTOR, 2R2, 0402, 1%, 63mW; ItemNo: 200024; Component Status: Active; Value: 2R2; Component Category: Resistor; Manufacturer: --; Supplier: Digi-Key; SupplierCatNo: 541-2.20LLCT-ND
TP200-TP205 = ALTIUM-0023: as TP1 on sheet Top-level; ItemNo: ALTIUM-0023; Value: TP-MDA; ClassName: MDA-Testpoint
TP206 TP207 = ALTIUM-0023: TESTPOINT FOR MDA-TEST, 1mm ROUND, SMD; Component Status: Active; Component Category: Misc; ItemNo: ALTIUM-0023; Value: TP-MDA; ClassName: MDA-Testpoint; Notes: -; TP_Type: -; TP_LegalValueRange: -; TP_Notes: -
U200 = 200353: ATSAMS70Q21A-CN, MCU, LFBGA144, 2048k Flash, 384k SRAM; Manufacturer: Atmel; Component Status: New; Component Category: Microcontroller IC; ItemNo: 200353; Value: ATSAMS70Q21A-CN; MPN: ATSAMS70Q21A-CN; Supplier: Farnell Norge; SupplierCatNo: 2484398; ClassName: -; Notes: -
U201 = 200282: IC, SYNCHRONOUS DRAM (SDRAM), 64MBIT, 6NS, 166MHZ, 4M x 16BIT, 54FBGA; Manufacturer: Winbond Electronics Corp.; Component Status: New; Component Category: Misc IC; ItemNo: 200282; Value: W9864G6JT-6I; MPN: W9864G6JT-6I; ClassName: -; Notes: -; Supplier: Digi-Key; SupplierCatNo: 1450-1257-ND
U202 = 200365: DSC6003JI2A-012.0000, 12MHZ CMOS MEMS OSCILLATOR 2.5X2MM; Manufacturer: Microchip Technology; Component Status: Active; Component Category: Misc; ItemNo: 200365; Value: DSC6003JI2A-012.0000; MPN: DSC6003JI2A-012.0000; Supplier: Digi-Key; SupplierCatNo: DSC6003JI2A-012.0000-ND; ClassName: -; Notes: -
Y200 = 200042: CRYSTAL, 32.768KHZ, 12.5PF, SMD; Manufacturer: Abracon; Component Status: Active; ItemNo: 200042; Value: ABS07-32.768KHZ-T; Component Category: Crystal; MPN: ABS07-32.768KHZ-T; Supplier: Farnell Norge; SupplierCatNo: 2101347

## Sheet Power.SchDoc: Power
size A3; CompanyName: Novelda AS; Organization: Novelda AS; Address1: Gjerdrums vei 8; Address2: NO-0484 Oslo; Address3: Norway; Revision: 1.A; SheetNumber: 2; SheetTotal: 3; Classification: Restricted; Size: A3; Project: X4M01; ProjectName: Prosject Name
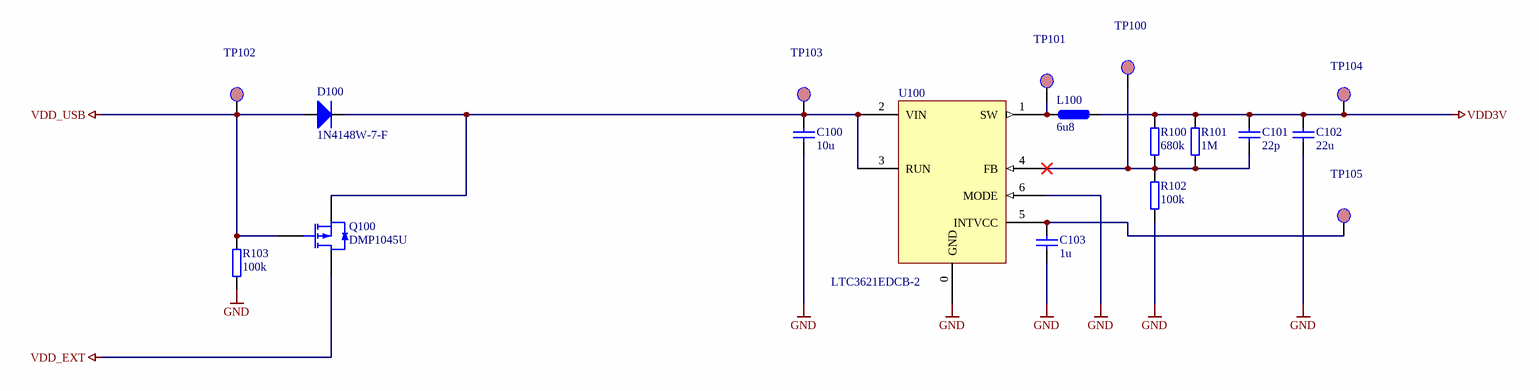
[diagram p2: Power.SchDoc]

### Parts
C100  10u  [0603-CAPACITOR-NONPOL]
C101  22p  [0402-CAPACITOR-NONPOL]
C102  22u  [0603-CAPACITOR-NONPOL]
C103  1u  [0402-CAPACITOR-NONPOL]
D100  1N4148W-7-F  [200048]
L100  6u8  [200059]
Q100  DMP1045U  [200049]
R100  680k  [0402-RESISTOR]
R101  1M  [0402-RESISTOR]
R102  100k  [0402-RESISTOR]
R103  100k  [0402-RESISTOR]
TP100  TP-MDA  [ALTIUM-0001]  (value not drawn)  (no BOM)
TP101  TP-MDA  [ALTIUM-0001]  (value not drawn)  (no BOM)
TP102  TP-MDA  [ALTIUM-0001]  (value not drawn)  (no BOM)
TP103  TP-MDA  [ALTIUM-0001]  (value not drawn)  (no BOM)
TP104  TP-MDA  [ALTIUM-0001]  (value not drawn)  (no BOM)
TP105  TP-MDA  [ALTIUM-0001]  (value not drawn)  (no BOM)
U100  LTC3621EDCB-2  [200038]

### Nets
GND: C100.1 C102.1 C103.1 R102.1 R103.1 U100.0(GND) U100.6(MODE)
VDD3V: C101.2 C102.2 L100.2 R100.2 R101.2 TP104.1
VDD_EXT: Q100.3(D)
VDD_USB: D100.A Q100.1(G) R103.2 TP102.1
NetC100_2: C100.2 D100.K Q100.2(S) TP103.1 U100.2(VIN) U100.3(RUN)
NetC101_1: C101.1 R100.1 R101.1 R102.2 TP100.1 U100.4(FB)
NetC103_2: C103.2 TP105.1 U100.5(INTVCC)
NetL100_1: L100.1 TP101.1 U100.1(SW)

### Notes on the sheet
- Size:
- Date:
- ItemNo:
- Sheet:
- of
- Title:
- Project:
- Classification:
- Copyright © 2017 Novelda AS

### Library data of the parts
C100 = 200011: as C219 on sheet MCU; Value: 10u; Component Category: Capacitor; Manufacturer: --; Supplier: Farnell Norge; SupplierCatNo: 2611921
C101 = 200060: CAPACITOR, 22p, 0402, 5%, 25V, NP0; ItemNo: 200060; Component Status: Active; Value: 22p; Component Category: Capacitor; Manufacturer: --; Supplier: Farnell Norge; SupplierCatNo: 2524767
C102 = 200236: CAPACITOR, 22u, 0603, 20%, 6V3, X5R; ItemNo: 200236; Component Status: Active; Value: 22u; Component Category: Capacitor; Manufacturer: --; ClassName: -; Notes: -; Supplier: Farnell Norge; SupplierCatNo: 2469395
C103 = 200001: as C209 on sheet MCU; Value: 1u; Component Category: Capacitor; Manufacturer: --; Supplier: Farnell Norge; SupplierCatNo: 1759381
D100 = 200164: as D1 on sheet Top-level; Value: 1N4148W-7-F; Component Category: Diode; Manufacturer: --; ClassName: -; Notes: -; Supplier: Digi-Key; SupplierCatNo: 1N4148W-FDICT-ND
L100 = 200059: INDUCTOR, PWR, 6.8UH,0.76A,10%,120MHZ; Manufacturer: Coilcraft; MPN: 1008PS-682KLB; Component Status: Active; ItemNo: 200059; Value: 6u8; Component Category: Inductor; Supplier: Farnell Norge; SupplierCatNo: 2286875
Q100 = 200049: MOSFET, P-CHANNEL, 12V, 4A, 31mOhm; Manufacturer: Diodes Incorporated; Component Status: Active; Component Category: Transistor; ItemNo: 200049; Value: DMP1045U; MPN: DMP1045U; Supplier: Farnell Norge; SupplierCatNo: 2061526
R100 = 200033: RESISTOR, 680k, 0402, 1%, 63mW; ItemNo: 200033; Component Status: Active; Value: 680k; Component Category: Resistor; Manufacturer: --; Supplier: Farnell Norge; SupplierCatNo: 2331556
R101 = 200023: RESISTOR, 1M, 0402, 5%, 63mW; ItemNo: 200023; Component Status: Active; Value: 1M; Component Category: Resistor; Manufacturer: --; Supplier: Farnell Norge; SupplierCatNo: 1174172
R102 R103 = 200027: as R200 on sheet MCU; Value: 100k; Component Category: Resistor; Manufacturer: --; Supplier: Farnell Norge; SupplierCatNo: 9239472
TP100-TP103 TP105 = ALTIUM-0023: as TP1 on sheet Top-level; ItemNo: ALTIUM-0023; Value: TP-MDA; ClassName: MDA-Testpoint
TP104 = ALTIUM-0023: TESTPOINT FOR MDA-TEST, 1mm ROUND, SMD; Component Status: Active; Component Category: Misc; TP_Type: Testjig,MDA; TP_Notes: VDD3V Output; ItemNo: ALTIUM-0023; Value: TP-MDA; ClassName: MDA-Testpoint
U100 = 200038: LTC3621EDCB-2, BUCK, 2.7-17V, 2.2MHZ, 1A, 0.6-17V, 6DFN; Manufacturer: Linear Technology; MPN: LTC3621EDCB-2#TRMBF; Component Status: Active; Component Category: Power Supply IC; ItemNo: 200038; Value: LTC3621EDCB-2; Supplier: Farnell Norge; SupplierCatNo: 2322398

## Nets that join several sheets
GND: Top-level (19 pins), MCU (58 pins), Power (7 pins)
VDD3V: Top-level (J1.1 LED1.1 P3.1), MCU (36 pins), Power (6 pins)
VDD_EXT: Top-level (D1.K P1.1 TP1.1), Power (Q100.3)
VDD_USB: Top-level (C1.2 FB1.1 R1.1), Power (D100.A Q100.1 R103.2 TP102.1)
IO1: Top-level (P1.11), MCU (U200.C9)
IO2: Top-level (P1.12), MCU (U200.K8)
IO3: Top-level (P1.13), MCU (U200.A10)
IO4: Top-level (P1.14), MCU (U200.C8)
IO5: Top-level (P1.15), MCU (U200.J8)
IO6: Top-level (P1.16), MCU (U200.J10)
IO7/WAKEUP: Top-level (P1.8 P3.6), MCU (U200.C10)
IO8/SWCLK: Top-level (P1.9 P3.4), MCU (U200.F9)
IO9/SWDIO: Top-level (P1.10 P3.2), MCU (U200.J11)
LED_B: Top-level (R4.2 TP5.1), MCU (U200.L6)
LED_G: Top-level (R5.2 TP7.1), MCU (U200.M5)
LED_R: Top-level (R3.2 TP6.1), MCU (U200.M6)
MISO/TX: Top-level (P1.4), MCU (U200.G3)
MOSI/RX: Top-level (P1.3), MCU (U200.H4)
nRESET: Top-level (P1.7 P3.10), MCU (R200.1 U200.H12)
nSS: Top-level (P1.6), MCU (U200.J2)
QSPI_IO0/SPI_MOSI: Top-level (J1.5), MCU (U200.M3)
QSPI_IO1/SPI_MISO: Top-level (J1.7), MCU (U200.L10)
QSPI_IO2: Top-level (J1.9), MCU (U200.J1)
QSPI_IO3: Top-level (J1.11), MCU (U200.D3)
QSPI_nSS/SPI_nSS: Top-level (J1.13), MCU (U200.J9)
QSPI_SCLK/SPI_SCLK: Top-level (J1.3), MCU (U200.K6)
SCLK: Top-level (P1.5), MCU (U200.B2)
TDI: Top-level (P3.8), MCU (U200.A12)
USBD_N: Top-level (P2.2 TP8.1 U1.2), MCU (U200.B4)
USBD_P: Top-level (P2.3 TP9.1 U1.3), MCU (U200.A4)
USBVBUS: Top-level (R1.2 R2.2 TP4.1), MCU (U200.E12)
X4_ENABLE: Top-level (J1.14), MCU (U200.M11)
X4_GPIO1: Top-level (J1.15), MCU (U200.K12)
X4_GPIO2: Top-level (J1.16), MCU (U200.F12)

## Assembly variants
Populated_Components: not fitted C2 R202 R203 TP1 TP2 TP3 TP4 TP5 TP6 TP7 TP8 TP9 TP10 TP11 TP12 TP100 TP101 TP102 TP103 TP104 TP105 TP200 TP201 TP202 TP203 TP204 TP205 TP206 TP207